# EAGLE schematic Indev 2 Control (EAGLE 6.3)
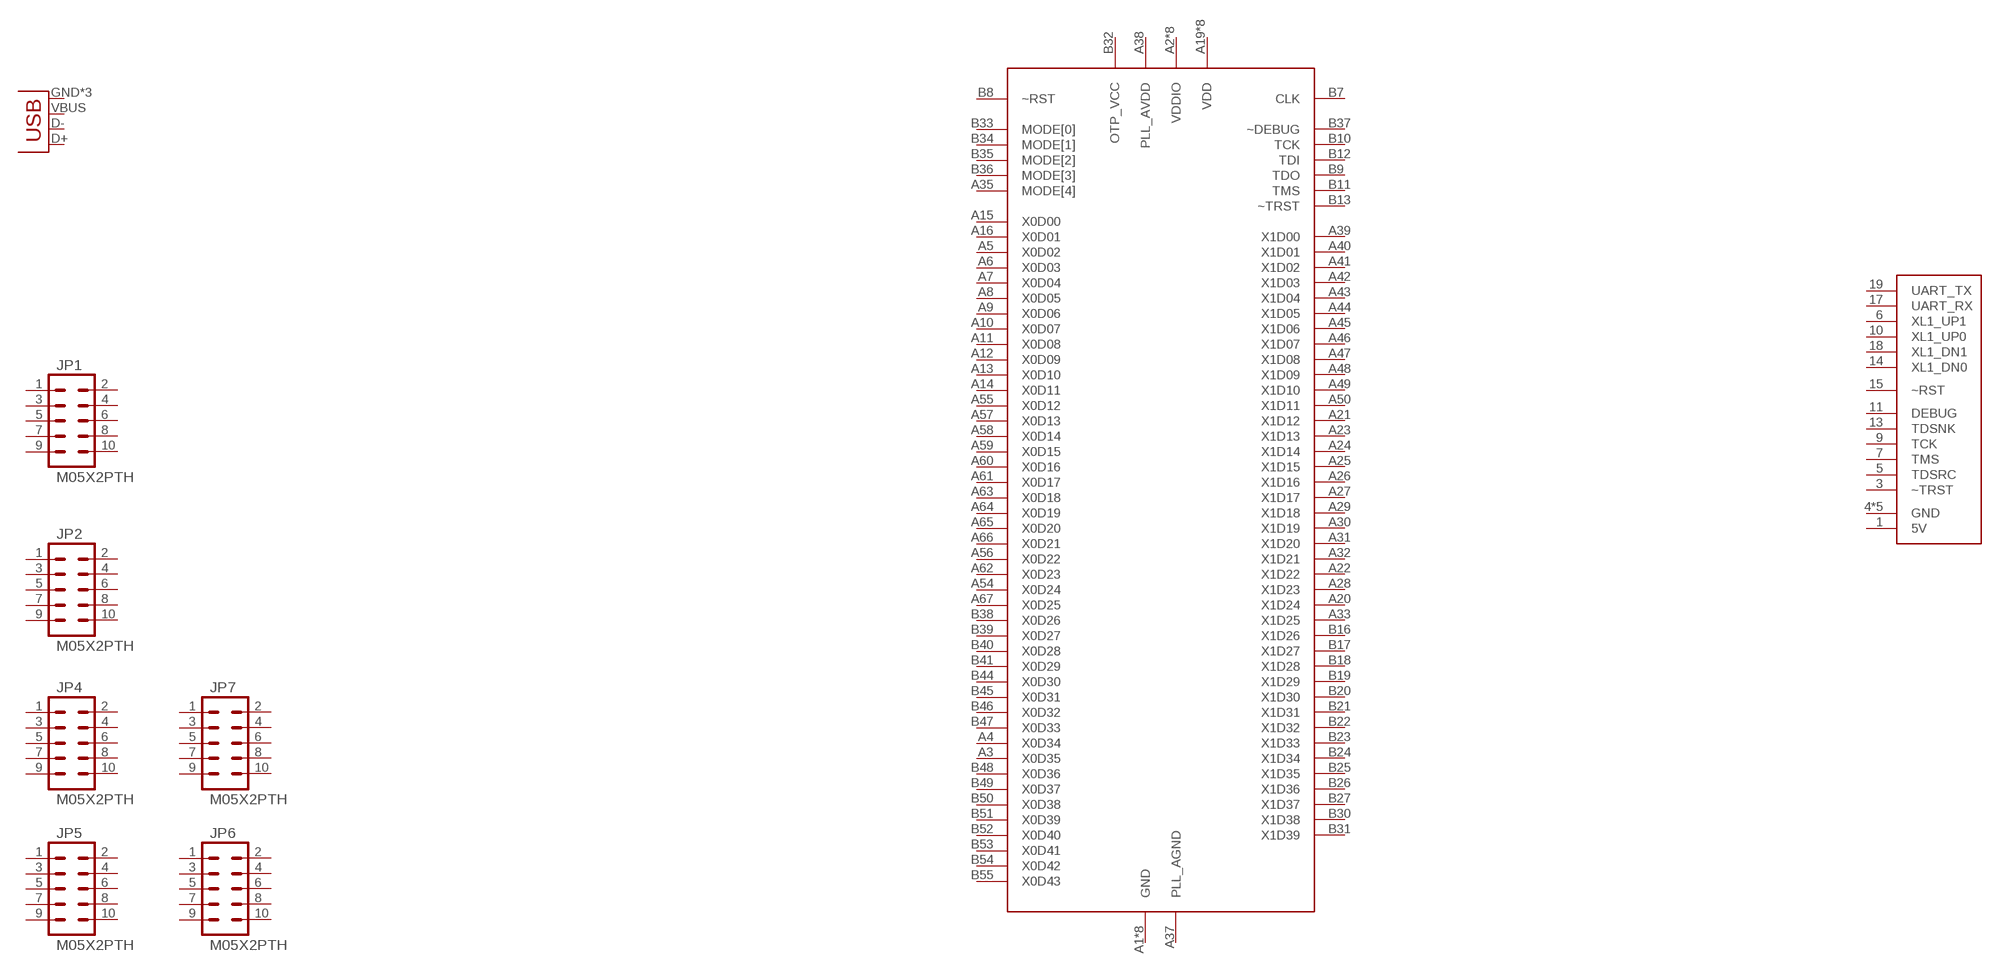
[diagram p0: schematic, sheet 1]

## Parts
JP1  M05X2PTH  [AVR_ICSP]
JP2  M05X2PTH  [AVR_ICSP]
JP3  USB-MICROB  [USB-MICROB]
JP4  M05X2PTH  [AVR_ICSP]
JP5  M05X2PTH  [AVR_ICSP]
JP6  M05X2PTH  [AVR_ICSP]
JP7  M05X2PTH  [AVR_ICSP]
U$1  XS1-L8A-128-QF124  [QFN-124]
U$2  XTAG-2  [MOLEX-52745-2097]
Unconnected: JP1.1 JP1.2 JP1.3 JP1.4 JP1.5 JP1.6 JP1.7 JP1.8 JP1.9 JP1.10 JP2.1 JP2.2 JP2.3 JP2.4 JP2.5 JP2.6 JP2.7 JP2.8 JP2.9 JP2.10 JP3.D+ JP3.D- JP3.GND JP3.MT1(GND) JP3.MT2(GND) JP3.VBUS JP4.1 JP4.2 JP4.3 JP4.4 JP4.5 JP4.6 JP4.7 JP4.8 JP4.9 JP4.10 JP5.1 JP5.2 JP5.3 JP5.4 JP5.5 JP5.6 JP5.7 JP5.8 JP5.9 JP5.10 JP6.1 JP6.2 JP6.3 JP6.4 JP6.5 JP6.6 JP6.7 JP6.8 JP6.9 JP6.10 JP7.1 JP7.2 JP7.3 JP7.4 JP7.5 JP7.6 JP7.7 JP7.8 JP7.9 JP7.10 U$1.A1(GND) U$1.A2(VDDIO) U$1.A3(X0D35) U$1.A4(X0D34) U$1.A5(X0D02) U$1.A6(X0D03) U$1.A7(X0D04) U$1.A8(X0D05) U$1.A9(X0D06) U$1.A10(X0D07) U$1.A11(X0D08) U$1.A12(X0D09) U$1.A13(X0D10) U$1.A14(X0D11) U$1.A15(X0D00) U$1.A16(X0D01) U$1.A17(VDDIO) U$1.A18(GND) U$1.A19(VDD) U$1.A20(X1D24) U$1.A21(X1D12) U$1.A22(X1D22) U$1.A23(X1D13) U$1.A24(X1D14) U$1.A25(X1D15) U$1.A26(X1D16) U$1.A27(X1D17) U$1.A28(X1D23) U$1.A29(X1D18) U$1.A30(X1D19) U$1.A31(X1D20) U$1.A32(X1D21) U$1.A33(X1D25) U$1.A34(VDD) U$1.A35(MODE[4]) U$1.A36(VDDIO) U$1.A37(PLL_AGND) U$1.A38(PLL_AVDD) U$1.A39(X1D00) U$1.A40(X1D01) U$1.A41(X1D02) U$1.A42(X1D03) U$1.A43(X1D04) U$1.A44(X1D05) U$1.A45(X1D06) U$1.A46(X1D07) U$1.A47(X1D08) U$1.A48(X1D09) U$1.A49(X1D10) U$1.A50(X1D11) U$1.A51(VDDIO) U$1.A52(GND) U$1.A53(VDD) U$1.A54(X0D24) U$1.A55(X0D12) U$1.A56(X0D22) U$1.A57(X0D13) U$1.A58(X0D14) U$1.A59(X0D15) U$1.A60(X0D16) U$1.A61(X0D17) U$1.A62(X0D23) U$1.A63(X0D18) U$1.A64(X0D19) U$1.A65(X0D20) U$1.A66(X0D21) U$1.A67(X0D25) U$1.A68(VDD) U$1.B1(VDDIO) U$1.B2(GND) U$1.B4(GND) U$1.B5(GND) U$1.B6(GND) U$1.B7(CLK) U$1.B8(~RST) U$1.B9(TDO) U$1.B10(TCK) U$1.B11(TMS) U$1.B12(TDI) U$1.B13(~TRST) U$1.B14(VDDIO) U$1.B15(VDD) U$1.B16(X1D26) U$1.B17(X1D27) U$1.B18(X1D28) U$1.B19(X1D29) U$1.B20(X1D30) U$1.B21(X1D31) U$1.B22(X1D32) U$1.B23(X1D33) U$1.B24(X1D34) U$1.B25(X1D35) U$1.B26(X1D36) U$1.B27(X1D37) U$1.B28(VDD) U$1.B29(VDDIO) U$1.B30(X1D38) U$1.B31(X1D39) U$1.B32(OTP_VCC) U$1.B33(MODE[0]) U$1.B34(MODE[1]) U$1.B35(MODE[2]) U$1.B36(MODE[3]) U$1.B37(~DEBUG) U$1.B38(X0D26) U$1.B39(X0D27) U$1.B40(X0D28) U$1.B41(X0D29) U$1.B42(VDDIO) U$1.B43(VDD) U$1.B44(X0D30) U$1.B45(X0D31) U$1.B46(X0D32) U$1.B47(X0D33) U$1.B48(X0D36) U$1.B49(X0D37) U$1.B50(X0D38) U$1.B51(X0D39) U$1.B52(X0D40) U$1.B53(X0D41) U$1.B54(X0D42) U$1.B55(X0D43) U$1.B56(VDD) U$1.PAD(GND) U$2.1(5V) U$2.3(~TRST) U$2.4(GND) U$2.5(TDSRC) U$2.6(XL1_UP1) U$2.7(TMS) U$2.8(GND) U$2.9(TCK) U$2.10(XL1_UP0) U$2.11(DEBUG) U$2.12(GND) U$2.13(TDSNK) U$2.14(XL1_DN0) U$2.15(~RST) U$2.16(GND) U$2.17(UART_RX) U$2.18(XL1_DN1) U$2.19(UART_TX) U$2.20(GND)

## Library data of the parts
JP1 JP2 JP4-JP7 = SparkFun-Connectors:M05X2: Header 5x2 Standard 10-pin dual row 0.1" header. Commonly used with AVR-ISP. Use with Spark Fun Electronics SKU: PRT-00778
JP3 = SparkFun-Connectors:USB: USB Connectors USB-B-PTH is fully proven SKU : PRT-00139/CONN-08278 USB-miniB is fully proven SKU : PRT-00587 USB-A-PCB is untested. USB-A-H is throughly reviewed, but untested. Spark Fun Electronics SKU : PRT-00437 USB-B-SMT is throughly reviewed, but untested. Needs silkscreen touching up. USB-A-S has not been used/tested USB-MB-H has not been used/tested USB-MICROB has been used. CONN-09505; PROD_ID: CONN-09505
U$1 = Strutz Electronic Industries:XS1-L8A-128-QF124
U$2 = Strutz Electronic Industries:XTAG-2